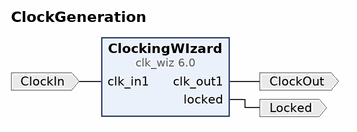
[diagram p0: block diagram of the top level]
# Vivado block design ClockGeneration, xc7z010clg400-1, Vivado 2018.3
create_bd_design ClockGeneration

create_bd_port -dir I -type clk ClockIn
set_property -dict {CONFIG.FREQ_HZ 125000000} [get_bd_ports ClockIn]
create_bd_port -dir O -type clk ClockOut
create_bd_port -dir O Locked

create_bd_cell -type ip -vlnv xilinx.com:ip:clk_wiz:6.0 ClockingWIzard
set_property -dict [list \
  CONFIG.CLKIN1_JITTER_PS 80.0 \
  CONFIG.CLKOUT1_JITTER 473.813 \
  CONFIG.CLKOUT1_PHASE_ERROR 351.816 \
  CONFIG.CLKOUT1_REQUESTED_OUT_FREQ 12.288 \
  CONFIG.MMCM_CLKFBOUT_MULT_F 42.750 \
  CONFIG.MMCM_CLKIN1_PERIOD 8.000 \
  CONFIG.MMCM_CLKIN2_PERIOD 10.000 \
  CONFIG.MMCM_CLKOUT0_DIVIDE_F 62.125 \
  CONFIG.MMCM_DIVCLK_DIVIDE 7 \
  CONFIG.PRIM_IN_FREQ 125 \
  CONFIG.RESET_PORT reset \
  CONFIG.RESET_TYPE ACTIVE_HIGH \
  CONFIG.USE_LOCKED true \
  CONFIG.USE_RESET false \
] [get_bd_cells ClockingWIzard]

# ---- connections ----

connect_bd_net -net clk_in1_0_1 [get_bd_ports ClockIn] [get_bd_pins ClockingWIzard/clk_in1]
connect_bd_net -net clk_wiz_0_clk_out1 [get_bd_pins ClockingWIzard/clk_out1] [get_bd_ports ClockOut]
connect_bd_net [get_bd_pins ClockingWIzard/locked] [get_bd_ports Locked]

validate_bd_design
save_bd_design
